# Altium schematic sheet ADS1299.schdoc
size A4
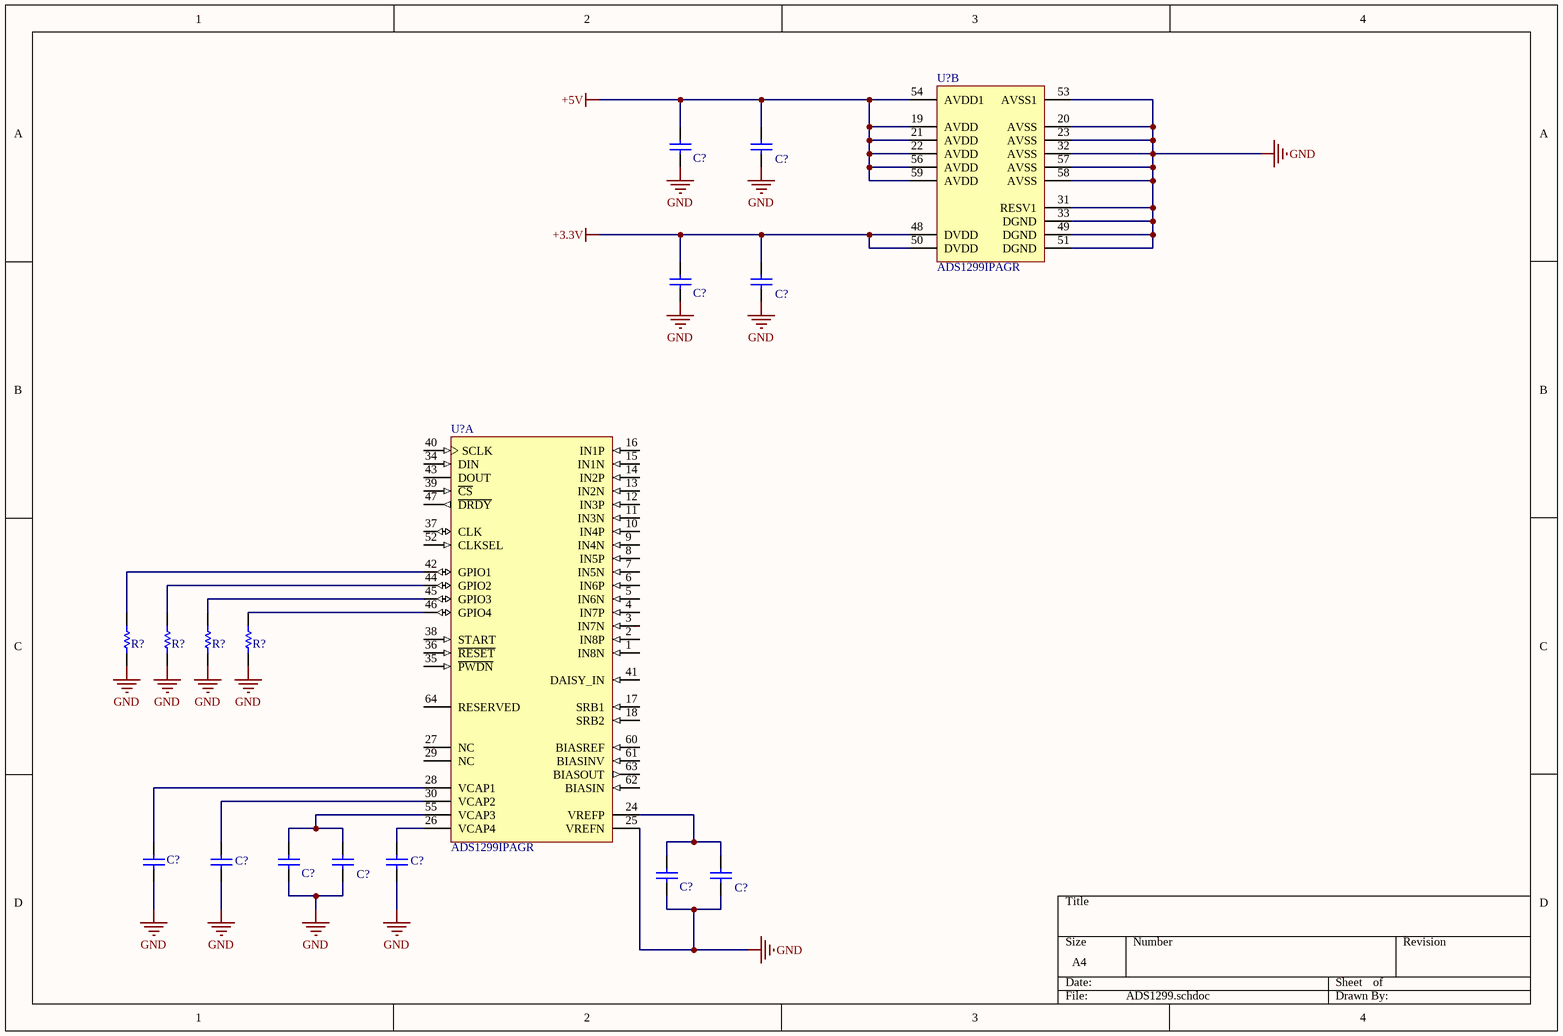
[diagram p0: ADS1299.schdoc]

## Parts
(Parts that share a designator on the sheet are numbered #1, #2 ... from top to bottom, then left to right.)
C?#1  GRM55DR72E105KW01L  [CAPC5750X200X30LL40]  (value not drawn)
C?#2  GRM155R71C104KA88D  [CAPC1005X55X25ML05T10]  (value not drawn)
C?#3  GRM55DR72E105KW01L  [CAPC5750X200X30LL40]  (value not drawn)
C?#4  GRM155R71C104KA88D  [CAPC1005X55X25ML05T10]  (value not drawn)
C?#5  GRM55DR72E105KW01L  [CAPC5750X200X30LL40]  (value not drawn)
C?#6  GRM55DR72E105KW01L  [CAPC5750X200X30LL40]  (value not drawn)
C?#7  GRM32ER60J107ME20L  [MURA-1210_H_2.7_M]  (value not drawn)
C?#8  GRM55DR72E105KW01L  [CAPC5750X200X30LL40]  (value not drawn)
C?#9  GRM155R71C104KA88D  [CAPC1005X55X25ML05T10]  (value not drawn)
C?#10  GRM55DR72E105KW01L  [CAPC5750X200X30LL40]  (value not drawn)
C?#11  GRM155R71C104KA88D  [CAPC1005X55X25ML05T10]  (value not drawn)
R?#1  ERJ-2RKF1003X  [RESC1005X40X25LL05T05]  (value not drawn)
R?#2  ERJ-2RKF1003X  [RESC1005X40X25LL05T05]  (value not drawn)
R?#3  ERJ-2RKF1003X  [RESC1005X40X25LL05T05]  (value not drawn)
R?#4  ERJ-2RKF1003X  [RESC1005X40X25LL05T05]  (value not drawn)
U?#1  ADS1299IPAGR  [PAG0064A_M]  (part B of 2)
U?#2  ADS1299IPAGR  [PAG0064A_M]  (part A of 2)

## Nets
+3.3V: C?#3.1 C?#4.2 U?#1.48(DVDD) U?#1.50(DVDD)
+5V: C?#1.1 C?#2.2 U?#1.19(AVDD) U?#1.21(AVDD) U?#1.22(AVDD) U?#1.54(AVDD1) U?#1.56(AVDD) U?#1.59(AVDD)
GND: C?#1.2 C?#2.1 C?#3.2 C?#4.1 C?#5.2 C?#6.2 C?#7.1 C?#8.1 C?#9.1 C?#10.1 C?#11.1 R?#1.1 R?#2.1 R?#3.1 R?#4.1 U?#1.20(AVSS) U?#1.23(AVSS) U?#1.31(RESV1) U?#1.32(AVSS) U?#1.33(DGND) U?#1.49(DGND) U?#1.51(DGND) U?#1.53(AVSS1) U?#1.57(AVSS) U?#1.58(AVSS) U?#2.25(VREFN)
NetC?#5_1: C?#5.1 U?#2.30(VCAP2)
NetC?#6_1: C?#6.1 U?#2.26(VCAP4)
NetC?#7_2: C?#7.2 U?#2.28(VCAP1)
NetC?#8_2: C?#8.2 C?#9.2 U?#2.55(VCAP3)
NetC?#10_2: C?#10.2 C?#11.2 U?#2.24(VREFP)
NetR?#1_2: R?#1.2 U?#2.42(GPIO1)
NetR?#2_2: R?#2.2 U?#2.44(GPIO2)
NetR?#3_2: R?#3.2 U?#2.45(GPIO3)
NetR?#4_2: R?#4.2 U?#2.46(GPIO4)

Not connected (* = marked no-connect by the designer): U?#2 1(IN8N) 2(IN8P) 3(IN7N) 4(IN7P) 5(IN6N) 6(IN6P) 7(IN5N) 8(IN5P) 9(IN4N) 10(IN4P) 11(IN3N) 12(IN3P) 13(IN2N) 14(IN2P) 15(IN1N) 16(IN1P) 17(SRB1) 18(SRB2) 27(NC) 29(NC) 34(DIN) 35(~{PWDN}) 36(~{RESET}) 37(CLK) 38(START) 39(~{CS}) 40(SCLK) 41(DAISY_IN) 43(DOUT) 47(~{DRDY}) 52(CLKSEL) 60(BIASREF) 61(BIASINV) 62(BIASIN) 63(BIASOUT) 64(RESERVED)

## Library data of the parts
C?#1 C?#3 C?#5 C?#6 C?#8 C?#10 = CMP-2000-06370-1: Chip Capacitor, 1 uF, +/- 10%, 250 V, -55 to 125 degC, 2220 (5750 Metric), RoHS, Tape and Reel; Manufacturer: Murata; Online Catalog: GRMSeries; Catalog Drawings: GRMSeries_2220_2.0; Capacitance: 1µF; Other Names: 490-3550-1; Voltage - Rated: 250V; Temperature Coefficient: X7R; Datasheet Version: 09/2016; Manufacturer URL: http://www.murata.com/; Lead Style: -; Mounting Technology: SurfaceMount; Family: CeramicCapacitors; Tolerance: ±10%; Datasheet URL: http://search.murata.co.jp/Ceramy/image/img/A01X/G101/ENG/GRM55DR72E105KW01-01.pdf; Lead Spacing: -; Size / Dimension: 0.224"Lx0.197"W(5.70mmx5.00mm); Packaging: CutTape(CT); Standard Package: 1; Ratings: -; Features: -; Series: GRM; Operating Temperature: -55°C~125°C; Category: Capacitors; Mounting Type: SurfaceMount,MLCC; Applications: GeneralPurpose; Package Description: 2-Pin Surface Mount Device, Body 5.7 x 5 mm; Package / Case: 2220(5750Metric); Thickness (Max): 0.087"(2.20mm); Package Reference: 2220; Height - Seated (Max): -
C?#2 C?#4 C?#9 C?#11 = CMP-2100-03641-1: Chip Capacitor, 0.1 uF, +/- 10%, 16 V, -55 to 125 degC, 0402 (1005 Metric), RoHS, Tape and Reel; Manufacturer: Murata; Material: Ceramic; Insulation Resistance: 10GR; Voltage: 16V; Dielectric: X7R; Capacitance: 100nF; REACH SVHC: NoSVHC; Depth: 0.5mm; Case/Package: 0402; Datasheet URL: http://psearch.en.murata.com/capacitor/product/GRM155R71C104KA88%23.pdf; Lead Free: LeadFree; Dielectric Material: Ceramic; Manufacturer URL: http://www.murata.com/; Min Operating Temperature: -55degC; Length: 1mm; Case Code (Metric): 1005; Radiation Hardening: No; Package Reference: 0402; RoHSCompliant: true; Datasheet Version: 42675.0; Thickness: 0.022inch; Packaging: TapeandReel; Voltage Rating (DC): 16V; Tolerance: 10%; Max Operating Temperature: 125degC; Package Description: 2-Pin Surface Mount Device, Body 1 x 0.5 mm; Mount: SurfaceMount; Height: 0.5mm; Width: 0.5mm; Number of Pins: 2; Voltage Rating: 16V; Case Code (Imperial): 0402; Termination: SMD/SMT; Package Quantity: 1
C?#7 = CMP-2000-05259-1: CAP, Ceramic, 100 uF, 20%, 6.3 V, 1210, RoHS, Tape and Reel; Manufacturer: MurataElectronics; Dielectric: X5R; Voltage: 6.3Vdc; Capacitance Value: 100uF; Product Depth: 2.5mm; Product Length: 3.2mm; Type: Flat; Rad Hard: No; Operating Temperature: -55to85degC; Datasheet URL: https://datasheet.ciiva.com/29199/455114-da-01-en-vs-kondensator-1210-29199468.pdf; Package/Case: 1210; Tolerance: 20%; Package Reference: 1210; Construction: Flat; Datasheet Version: Dec-10; Product Height: 2.5mm; Package Description: 2-Pin Surface Mount Device, Body 3.2 x 2.5 mm; Mounting: SurfaceMount; Category: CapacitorCeramicMultilayer; Manufacturer URL: http://www.murata.com/
R?#1-R?#4 = CMP-2002-00608-3: Chip Resistor, 100 KOhm, +/- 1%, 100 mW, -55 to 155 degC, 0402 (1005 Metric), RoHS, Tape and Reel; Manufacturer: Basic Passives; Power Rating: 100 mW; Voltage Rating: 50 V; Case\/Package: 0402; Case Code (Imperial): 0402; RoHSCompliant: true; Min Operating Temperature: -55 degC; Mount: Surface Mount; Packaging: Tape and Reel; PackageDescription: 2-Pin Surface Mount Device, Body 1 x 0.5 mm; Tolerance: 1%; REACH SVHC: Yes; ComponentLink1URL: http://www.panasonic.com/; Resistance: 100 KOhm; ComponentLink1Description: Manufacturer URL; Package Quantity: 10000; Mounting Technology: Surface Mount; DatasheetVersion: 04/2015; PartNumber: ERJ-2RKF1003X; Height: 0.35 mm; Pins: 2; Length: 1 mm; Max Operating Temperature: 155 degC; ComponentLink2Description: Datasheet; ComponentLink2URL: http://industrial.panasonic.com/cdbs/www-data/pdf/RDA0000/AOA0000C86.pdf; PackageReference: 0402; Radiation Hardening: No; Width: 0.5 mm; Case Code (Metric): 1005
U?#1 U?#2 = CMP-0841-00001-2: Low-Noise, 8-Channel, 24-Bit Analog Front-End for Biopotential Measurement, 16 KSPS, -40 to 85 degC, 64-Pin PQFP (PAG-64), RoHS, Tape and Reel; Manufacturer: Texas Instruments; Architecture: Delta-Sigma; Interface: Serial SPI; # Input Channels: 8; Sample Rate (max) (KSPS): 16; Packing: PAG0064A; Reference Mode: Int, Ext; Resolution (Bits): 24; PackageReference: PAG-64; ComponentLink2Description: Datasheet; Operating Temperature Range (C): -40 to 85; ComponentLink1Description: Manufacturer URL; Mounting Technology: Surface Mount; ComponentLink3Description: Package Specification; PartNumber: ADS1299IPAGR; PackageDescription: 64-Pin Plastic Quad Flatpack, Body 10 x 10 mm, Pitch 0.5 mm; ComponentLink2URL: http://www.ti.com/lit/ds/symlink/ads1299.pdf; PackageVersion: 4040282/C; ComponentLink1URL: http://www.ti.com/; ComponentLink3URL: http://www.ti.com/lit/ml/mtqf006a/mtqf006a.pdf; RoHS: TRUE; DatasheetVersion: SBAS499A